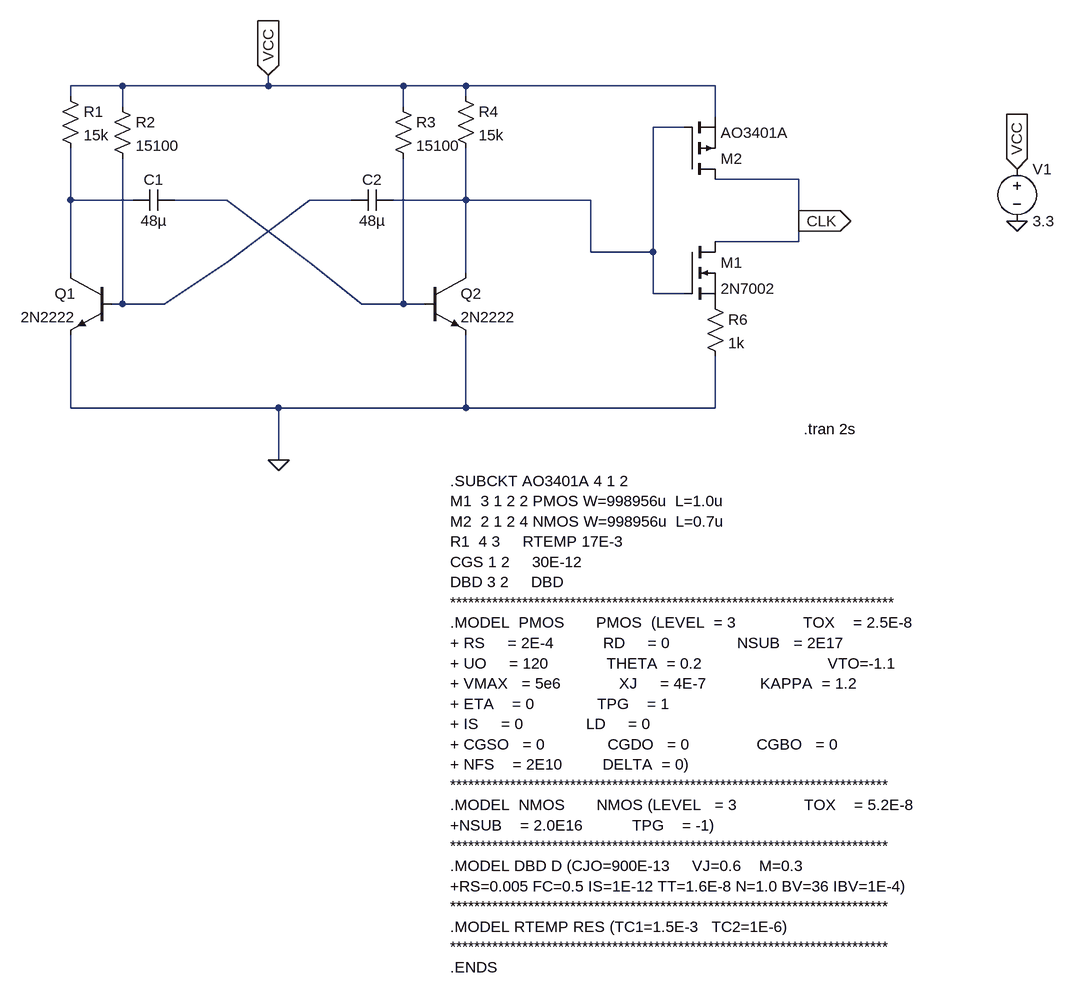
[diagram p0: schematic astable-multivibrator-clkv.asc]
astable-multivibrator-clkv.asc, the LTspice schematic file:
Version 4.1
SHEET 1 1084 1512
WIRE -544 160 -624 160
WIRE -320 160 -320 144
WIRE -320 160 -544 160
WIRE -112 160 -320 160
WIRE -16 160 -112 160
WIRE 368 160 -16 160
WIRE -624 176 -624 160
WIRE -16 176 -16 160
WIRE -544 192 -544 160
WIRE -112 192 -112 160
WIRE 368 208 368 160
WIRE 320 224 272 224
WIRE 496 304 368 304
WIRE -624 336 -624 256
WIRE -528 336 -624 336
WIRE -384 336 -464 336
WIRE -192 336 -256 336
WIRE -16 336 -16 256
WIRE -16 336 -128 336
WIRE 176 336 -16 336
WIRE 496 368 496 304
WIRE 496 400 496 368
WIRE 496 400 368 400
WIRE 176 416 176 336
WIRE 272 416 272 224
WIRE 272 416 176 416
WIRE -384 432 -256 336
WIRE -256 432 -384 336
WIRE -624 448 -624 336
WIRE -16 448 -16 336
WIRE 272 480 272 416
WIRE 320 480 272 480
WIRE -544 496 -544 272
WIRE -544 496 -560 496
WIRE -480 496 -384 432
WIRE -480 496 -544 496
WIRE -176 496 -256 432
WIRE -112 496 -112 272
WIRE -112 496 -176 496
WIRE -80 496 -112 496
WIRE -624 656 -624 544
WIRE -304 656 -624 656
WIRE -16 656 -16 544
WIRE -16 656 -304 656
WIRE 368 656 368 576
WIRE 368 656 -16 656
WIRE -304 736 -304 656
FLAG -304 736 0
FLAG 496 368 CLK
IOPIN 496 368 Out
FLAG -320 144 VCC
IOPIN -320 144 In
FLAG 832 368 0
FLAG 832 288 VCC
IOPIN 832 288 In
SYMBOL Res -640 160 R0
SYMATTR InstName R1
SYMATTR Value 15k
SYMBOL Res -32 160 R0
SYMATTR InstName R4
SYMATTR Value 15k
SYMBOL Cap -128 320 R90
WINDOW 0 0 32 VBottom 2
WINDOW 3 32 32 VTop 2
SYMATTR InstName C2
SYMATTR Value 48µ
SYMBOL Cap -464 320 R90
WINDOW 0 0 32 VBottom 2
WINDOW 3 32 32 VTop 2
SYMATTR InstName C1
SYMATTR Value 48µ
SYMBOL npn -560 448 M0
SYMATTR InstName Q1
SYMATTR Value 2N2222
SYMBOL npn -80 448 R0
SYMATTR InstName Q2
SYMATTR Value 2N2222
SYMBOL Res -128 176 R0
SYMATTR InstName R3
SYMATTR Value 15100
SYMBOL Res -560 176 R0
SYMATTR InstName R2
SYMATTR Value 15100
SYMBOL nmos 320 400 R0
SYMATTR InstName M1
SYMATTR Value 2N7002
SYMBOL pmos 320 304 M180
SYMATTR InstName M2
SYMATTR Value AO3401A
SYMATTR Prefix X
SYMBOL res 352 480 R0
SYMATTR InstName R6
SYMATTR Value 1k
SYMBOL voltage 832 272 R0
WINDOW 123 0 0 Left 0
WINDOW 39 0 0 Left 0
SYMATTR InstName V1
SYMATTR Value 3.3
TEXT -40 768 Left 2 !.SUBCKT AO3401A 4 1 2\nM1  3 1 2 2 PMOS W=998956u  L=1.0u \nM2  2 1 2 4 NMOS W=998956u  L=0.7u\nR1  4 3     RTEMP 17E-3\nCGS 1 2     30E-12\nDBD 3 2     DBD\n**************************************************************************\n.MODEL  PMOS       PMOS  (LEVEL  = 3               TOX    = 2.5E-8\n+ RS     = 2E-4           RD     = 0               NSUB   = 2E17  \n+ UO     = 120             THETA  = 0.2                            VTO=-1.1\n+ VMAX   = 5e6             XJ     = 4E-7            KAPPA  = 1.2\n+ ETA    = 0              TPG    = 1  \n+ IS     = 0              LD     = 0                           \n+ CGSO   = 0              CGDO   = 0               CGBO   = 0 \n+ NFS    = 2E10         DELTA  = 0)\n*************************************************************************\n.MODEL  NMOS       NMOS (LEVEL   = 3               TOX    = 5.2E-8\n+NSUB    = 2.0E16           TPG    = -1)   \n*************************************************************************\n.MODEL DBD D (CJO=900E-13     VJ=0.6    M=0.3\n+RS=0.005 FC=0.5 IS=1E-12 TT=1.6E-8 N=1.0 BV=36 IBV=1E-4)\n*************************************************************************\n.MODEL RTEMP RES (TC1=1.5E-3   TC2=1E-6)\n*************************************************************************\n.ENDS
TEXT 504 688 Left 2 !.tran 2s

The netlist it stands for:
* astable-multivibrator-clkv.asc
R1 VCC N002 15k
R4 VCC N001 15k
C2 N001 N004 48µ
C1 N003 N002 48µ
Q1 N002 N004 0 0 2N2222
Q2 N001 N003 0 0 2N2222
R3 VCC N003 15100
R2 VCC N004 15100
M1 CLK N001 P001 P001 2N7002
X§M2 CLK N001 VCC AO3401A  ; pins D G S
R6 P001 0 1k
V1 VCC 0 3.3
.model NPN NPN
.model PNP PNP
.lib standard.bjt
.model NMOS NMOS
.model PMOS PMOS
.lib standard.mos
.SUBCKT AO3401A 4 1 2
M1  3 1 2 2 PMOS W=998956u  L=1.0u
M2  2 1 2 4 NMOS W=998956u  L=0.7u
R1  4 3     RTEMP 17E-3
CGS 1 2     30E-12
DBD 3 2     DBD
**************************************************************************
.MODEL  PMOS       PMOS  (LEVEL  = 3               TOX    = 2.5E-8
+ RS     = 2E-4           RD     = 0               NSUB   = 2E17
+ UO     = 120             THETA  = 0.2                            VTO=-1.1
+ VMAX   = 5e6             XJ     = 4E-7            KAPPA  = 1.2
+ ETA    = 0              TPG    = 1
+ IS     = 0              LD     = 0
+ CGSO   = 0              CGDO   = 0               CGBO   = 0
+ NFS    = 2E10         DELTA  = 0)
*************************************************************************
.MODEL  NMOS       NMOS (LEVEL   = 3               TOX    = 5.2E-8
+NSUB    = 2.0E16           TPG    = -1)
*************************************************************************
.MODEL DBD D (CJO=900E-13     VJ=0.6    M=0.3
+RS=0.005 FC=0.5 IS=1E-12 TT=1.6E-8 N=1.0 BV=36 IBV=1E-4)
*************************************************************************
.MODEL RTEMP RES (TC1=1.5E-3   TC2=1E-6)
*************************************************************************
.ENDS
.tran 2s
.backanno
.end